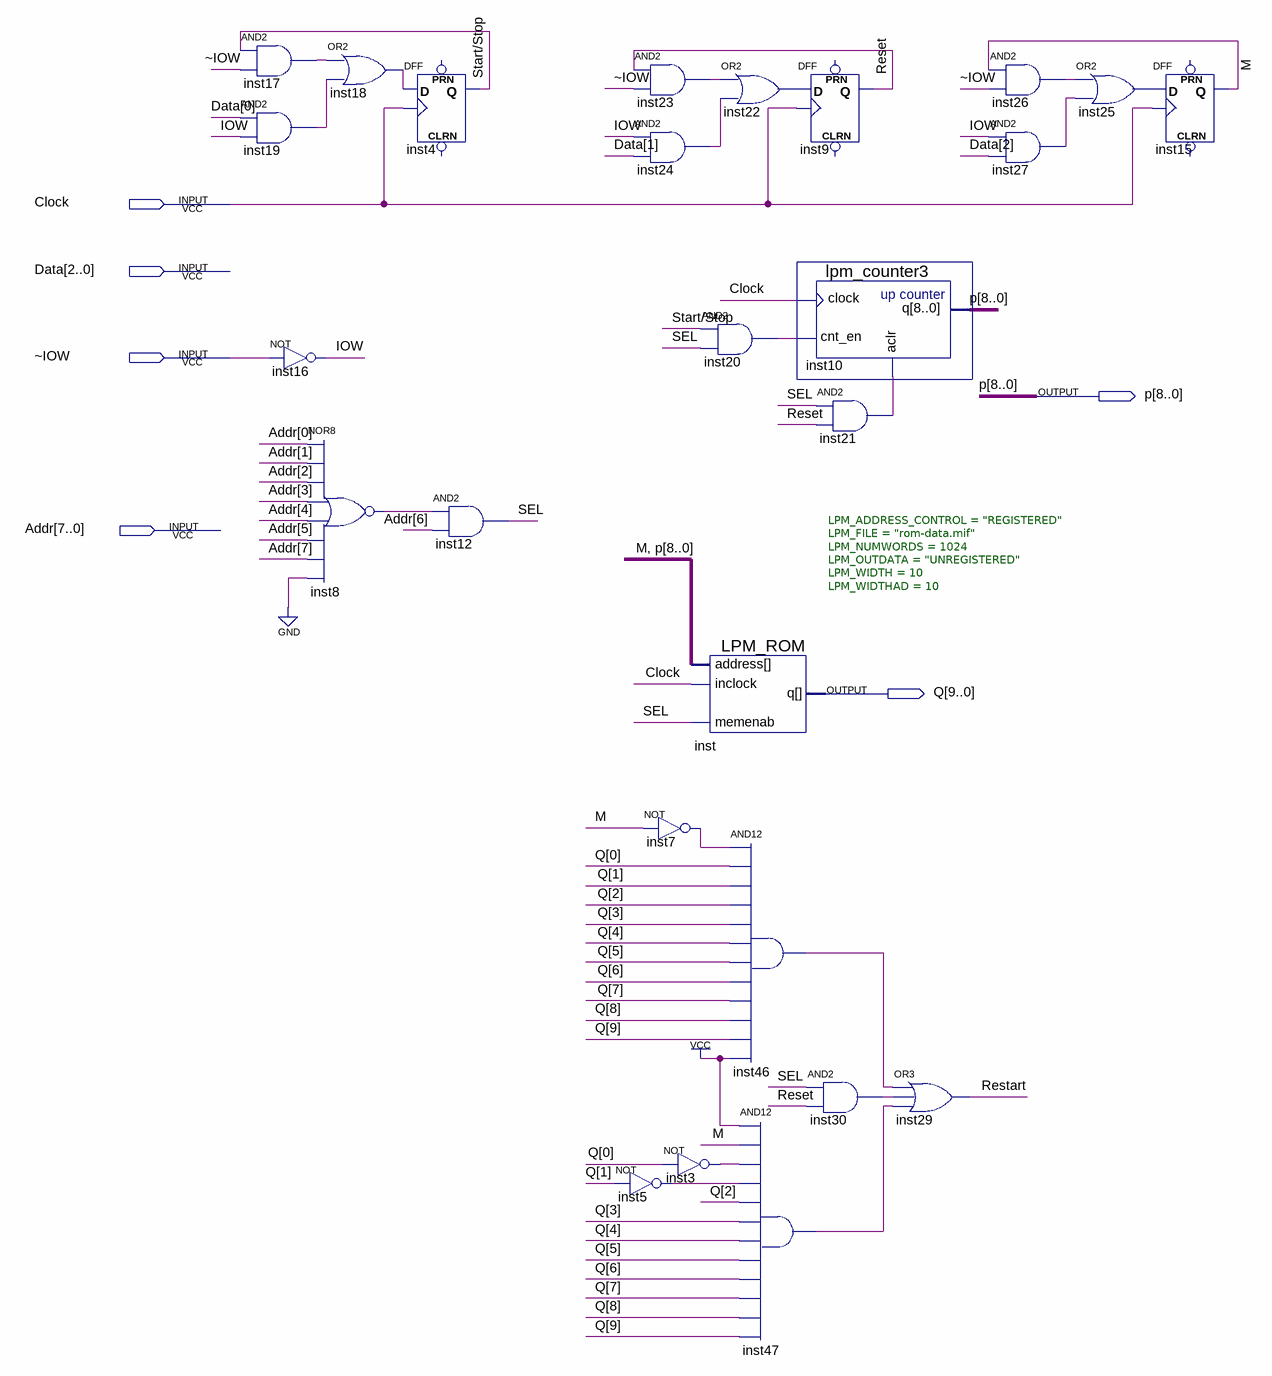
[diagram p0: schematic sheet]
// Quartus schematic 2.bdf as structural Verilog: 26 symbols, 6 pins
module \2  (
  input  Clock,
  input  [2:0] Data,
  input  \~IOW ,
  input  [7:0] Addr,
  output [8:0] p,
  output [9:0] Q
);

  wire inst3_out, inst5_out, inst7_out, inst8_out, inst17_out, inst18_out, inst19_out, inst20_out,
       inst21_out, inst22_out, inst23_out, inst24_out, inst25_out, inst26_out, inst27_out, inst30_out,
       inst46_out, inst47_out, IOW, M, Reset, Restart, SEL, \Start/Stop ;

  and inst17 (inst17_out, \Start/Stop , \~IOW );
  and inst19 (inst19_out, Data[0], IOW);
  or inst18 (inst18_out, inst17_out, inst19_out);
  not inst16 (IOW, \~IOW );
  nor inst8 (inst8_out, Addr[0], Addr[1], Addr[2], Addr[3], Addr[4], Addr[5], Addr[7], 1'b0);
  DFF inst4 (.CLK(Clock), .D(inst18_out), .Q(\Start/Stop ));  // open: CLRN, PRN
  and inst12 (SEL, inst8_out, Addr[6]);
  and inst23 (inst23_out, Reset, \~IOW );
  and inst24 (inst24_out, IOW, Data[1]);
  not inst7 (inst7_out, M);
  not inst5 (inst5_out, Q[1]);
  or inst22 (inst22_out, inst23_out, inst24_out);
  and inst20 (inst20_out, \Start/Stop , SEL);
  LPM_ROM #(.LPM_ADDRESS_CONTROL("REGISTERED"), .LPM_FILE("rom-data.mif"), .LPM_NUMWORDS(1024), .LPM_OUTDATA("UNREGISTERED"), .LPM_WIDTH(10), .LPM_WIDTHAD(10)) inst (
    .address({M, p}), .inclock(Clock), .memenab(SEL), .q(Q));
  not inst3 (inst3_out, Q[0]);
  DFF inst9 (.CLK(Clock), .D(inst22_out), .Q(Reset));  // open: CLRN, PRN
  lpm_counter3 inst10 (.clock(Clock), .cnt_en(inst20_out), .aclr(inst21_out), .q(p));
  and inst46 (inst46_out, inst7_out, Q[0], Q[1], Q[2], Q[3], Q[4], Q[5], Q[6], Q[7], Q[8], Q[9], 1'b1);
  and inst47 (inst47_out, 1'b1, M, inst3_out, inst5_out, Q[2], Q[3], Q[4], Q[5], Q[6], Q[7], Q[8], Q[9]);
  and inst21 (inst21_out, SEL, Reset);
  and inst30 (inst30_out, SEL, Reset);
  or inst29 (Restart, inst46_out, inst30_out, inst47_out);
  and inst26 (inst26_out, M, \~IOW );
  and inst27 (inst27_out, IOW, Data[2]);
  or inst25 (inst25_out, inst26_out, inst27_out);
  DFF inst15 (.CLK(Clock), .D(inst25_out), .Q(M));  // open: CLRN, PRN
endmodule
